# Altium schematic sheet connect.SchDoc
size B; SheetNumber: 3; SheetTotal: 3
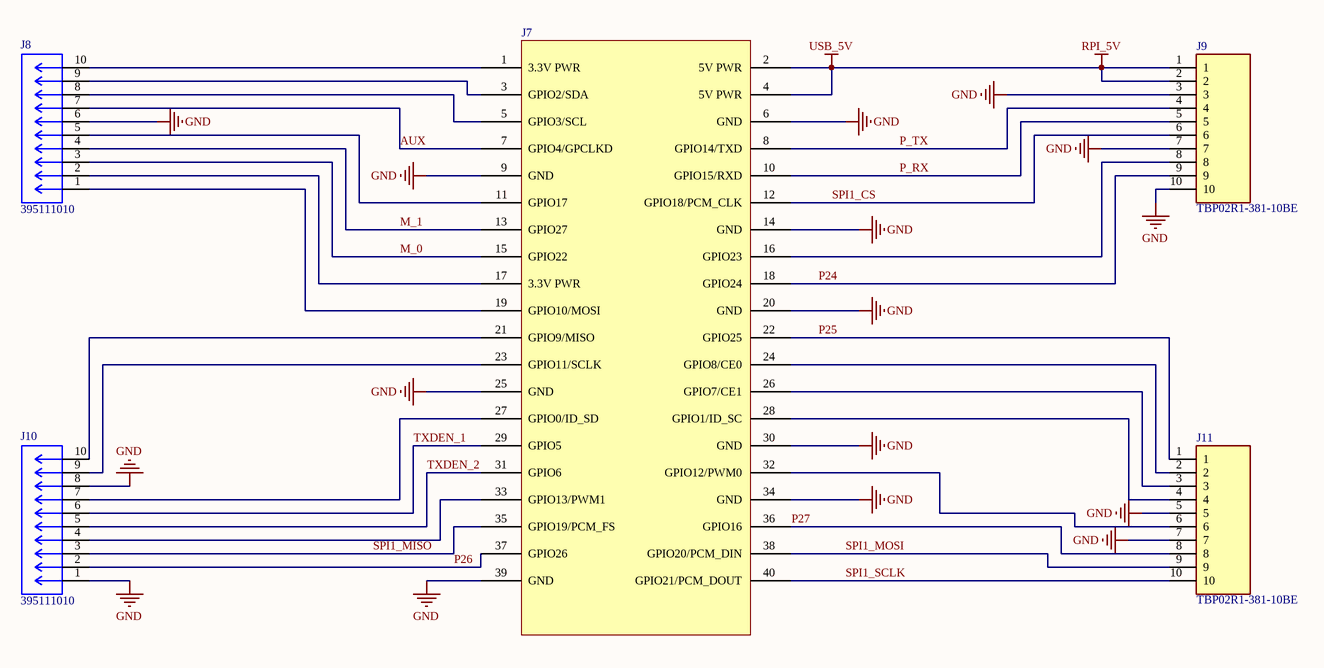
[diagram p0: connect.SchDoc]

## Parts
J7  (no value)  [GPIO_INTERFACE]
J8  395111010  [CONN_SD-39511-001_10P_MOL]
J9  TBP02R1-381-10BE  [CUI_TBP02R1-381-10BE]
J10  395111010  [CONN_SD-39511-001_10P_MOL]
J11  TBP02R1-381-10BE  [CUI_TBP02R1-381-10BE]

## Nets
GND: J7.6(GND) J7.9(GND) J7.14(GND) J7.20(GND) J7.25(GND) J7.30(GND) J7.34(GND) J7.39(GND) J8.6 J9.3 J9.7 J9.10 J10.1 J10.8 J11.5 J11.7
RPI_5V: J7.2(5V_PWR) J7.4(5V_PWR) J9.1 J9.2  [also labelled USB_5V]
AUX: J7.7(GPIO4/GPCLKD) J8.7
M_0: J7.15(GPIO22) J8.3
M_1: J7.13(GPIO27) J8.4
P24: J7.18(GPIO24) J9.9
P25: J7.22(GPIO25) J11.1
P26: J7.37(GPIO26) J10.2
P27: J7.36(GPIO16) J11.8
P_RX: J7.10(GPIO15/RXD) J9.5
P_TX: J7.8(GPIO14/TXD) J9.4
SPI1_CS: J7.12(GPIO18/PCM_CLK) J9.6
SPI1_MISO: J7.35(GPIO19/PCM_FS) J10.3
SPI1_MOSI: J7.38(GPIO20/PCM_DIN) J11.9
SPI1_SCLK: J7.40(GPIO21/PCM_DOUT) J11.10
TXDEN_1: J7.29(GPIO5) J10.6
TXDEN_2: J7.31(GPIO6) J10.5
NetJ7_1: J7.1(3.3V_PWR) J8.10
NetJ7_3: J7.3(GPIO2/SDA) J8.9
NetJ7_5: J7.5(GPIO3/SCL) J8.8
NetJ7_11: J7.11(GPIO17) J8.5
NetJ7_16: J7.16(GPIO23) J9.8
NetJ7_17: J7.17(3.3V_PWR) J8.2
NetJ7_19: J7.19(GPIO10/MOSI) J8.1
NetJ7_21: J7.21(GPIO9/MISO) J10.10
NetJ7_23: J7.23(GPIO11/SCLK) J10.9
NetJ7_24: J7.24(GPIO8/CE0) J11.2
NetJ7_26: J7.26(GPIO7/CE1) J11.3
NetJ7_27: J7.27(GPIO0/ID_SD) J10.7
NetJ7_28: J7.28(GPIO1/ID_SC) J11.4
NetJ7_32: J7.32(GPIO12/PWM0) J11.6
NetJ7_33: J7.33(GPIO13/PWM1) J10.4

## Library data of the parts
J7 = RASPBERRY_INTERFACE
J8 J10 = 395111010: Pluggable Terminal Blocks 3.81MM EURO HEADER V EADER VERT BLK 10CKT; MF: Molex; SnapEDA_Link: https://www.snapeda.com/parts/395111010/Molex/view-part/?ref=snap; Package: None; Value: *; MP: 395111010; Check_prices: https://www.snapeda.com/parts/395111010/Molex/view-part/?ref=eda
J9 J11 = TBP02R1-381-10BE: 2â€“24 Ð¿Ð¾Ð»ÑŽÑÐ°, Ð¿Ð¾Ð´ÐºÐ»ÑŽÑ‡Ð°ÐµÐ¼Ñ‹Ðµ, Ñ Ñ€Ð¾Ð·ÐµÑ‚ÐºÐ¾Ð¹, Ð³Ð¾Ñ€Ð¸Ð·Ð¾Ð½Ñ‚Ð°Ð»ÑŒÐ½Ñ‹Ðµ, Ñ ÑˆÐ°Ð³Ð¾Ð¼ 3,81, ÐºÐ»ÐµÐ¼Ð¼Ð½Ð°Ñ ÐºÐ¾Ð»Ð¾Ð´ÐºÐ°; MF: Same Sky; SnapEDA_Link: https://www.snapeda.com/parts/TBP02R1-381-10BE/Same+Sky/view-part/?ref=snap; Package: None; Value: *; MP: TBP02R1-381-10BE; Check_prices: https://www.snapeda.com/parts/TBP02R1-381-10BE/Same+Sky/view-part/?ref=eda